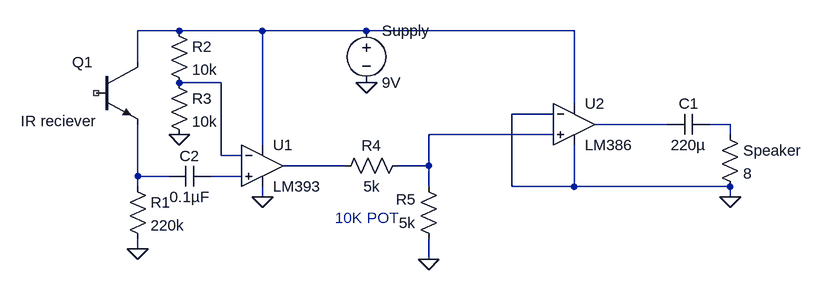
[diagram p0: schematic Rx.asc]
Rx.asc, the LTspice schematic file:
Version 4
SHEET 1 1220 680
WIRE 256 -80 192 -80
WIRE 384 -80 256 -80
WIRE 544 -80 384 -80
WIRE 864 -80 544 -80
WIRE 192 -32 192 -80
WIRE 320 0 256 0
WIRE 864 32 864 -80
WIRE 832 48 768 48
WIRE 1008 64 896 64
WIRE 1104 64 1072 64
WIRE 832 80 640 80
WIRE 1104 80 1104 64
WIRE 384 96 384 -80
WIRE 320 112 320 0
WIRE 352 112 320 112
WIRE 512 128 416 128
WIRE 640 128 640 80
WIRE 640 128 592 128
WIRE 192 144 192 64
WIRE 240 144 192 144
WIRE 352 144 304 144
WIRE 192 160 192 144
WIRE 640 160 640 128
WIRE 768 160 768 48
WIRE 864 160 864 96
WIRE 864 160 768 160
WIRE 1104 160 864 160
WIRE 384 176 384 160
WIRE 1104 176 1104 160
WIRE 192 256 192 240
WIRE 640 272 640 240
FLAG 192 256 0
FLAG 544 0 0
FLAG 384 176 0
FLAG 256 80 0
FLAG 1104 176 0
FLAG 640 272 0
SYMBOL voltage 544 -96 R0
SYMATTR InstName Supply
SYMATTR Value 9V
SYMBOL res 176 144 R0
SYMATTR InstName R1
SYMATTR Value 220k
SYMBOL npn 128 -32 R0
WINDOW 0 -37 0 Left 2
WINDOW 3 -116 91 Left 2
SYMATTR InstName Q1
SYMATTR Value IR reciever
SYMBOL OpAmps\\opamp2 384 64 R0
SYMATTR InstName U1
SYMATTR Value LM393
SYMBOL res 240 -96 R0
SYMATTR InstName R2
SYMATTR Value 10k
SYMBOL res 240 -16 R0
SYMATTR InstName R3
SYMATTR Value 10k
SYMBOL cap 1072 48 R90
WINDOW 0 0 32 VBottom 2
WINDOW 3 32 32 VTop 2
SYMATTR InstName C1
SYMATTR Value 220µ
SYMBOL res 1088 64 R0
SYMATTR InstName Speaker
SYMATTR Value 8
SYMBOL OpAmps\\opamp2 864 0 R0
SYMATTR InstName U2
SYMATTR Value LM386
SYMBOL cap 304 128 R90
WINDOW 0 0 32 VBottom 2
WINDOW 3 32 32 VTop 2
SYMATTR InstName C2
SYMATTR Value 0.1µF
SYMBOL res 608 112 R90
WINDOW 0 0 56 VBottom 2
WINDOW 3 32 56 VTop 2
SYMATTR InstName R4
SYMATTR Value 5k
SYMBOL res 656 256 R180
WINDOW 0 36 76 Left 2
WINDOW 3 36 40 Left 2
SYMATTR InstName R5
SYMATTR Value 5k
TEXT 496 208 Left 2 ;10K POT

The netlist it stands for:
* Rx.asc
V§Supply N001 0 9V
R1 N007 0 220k
Q1 N001 NC_01 N007 0 IR reciever
XU1 N008 N002 N001 0 N006 LM393  ; pins In+ In- V+ V- OUT
R2 N001 N002 10k
R3 N002 0 10k
C1 N004 N003 220µ
R§Speaker N004 0 8
XU2 N005 0 N001 0 N003 LM386  ; pins In+ In- V+ V- OUT
C2 N008 N007 0.1µF
R4 N005 N006 5k
R5 0 N005 5k
.model NPN NPN
.model PNP PNP
.lib standard.bjt
* 10K POT
.backanno
.end